# EAGLE design P2 (EAGLE 8.7.1)
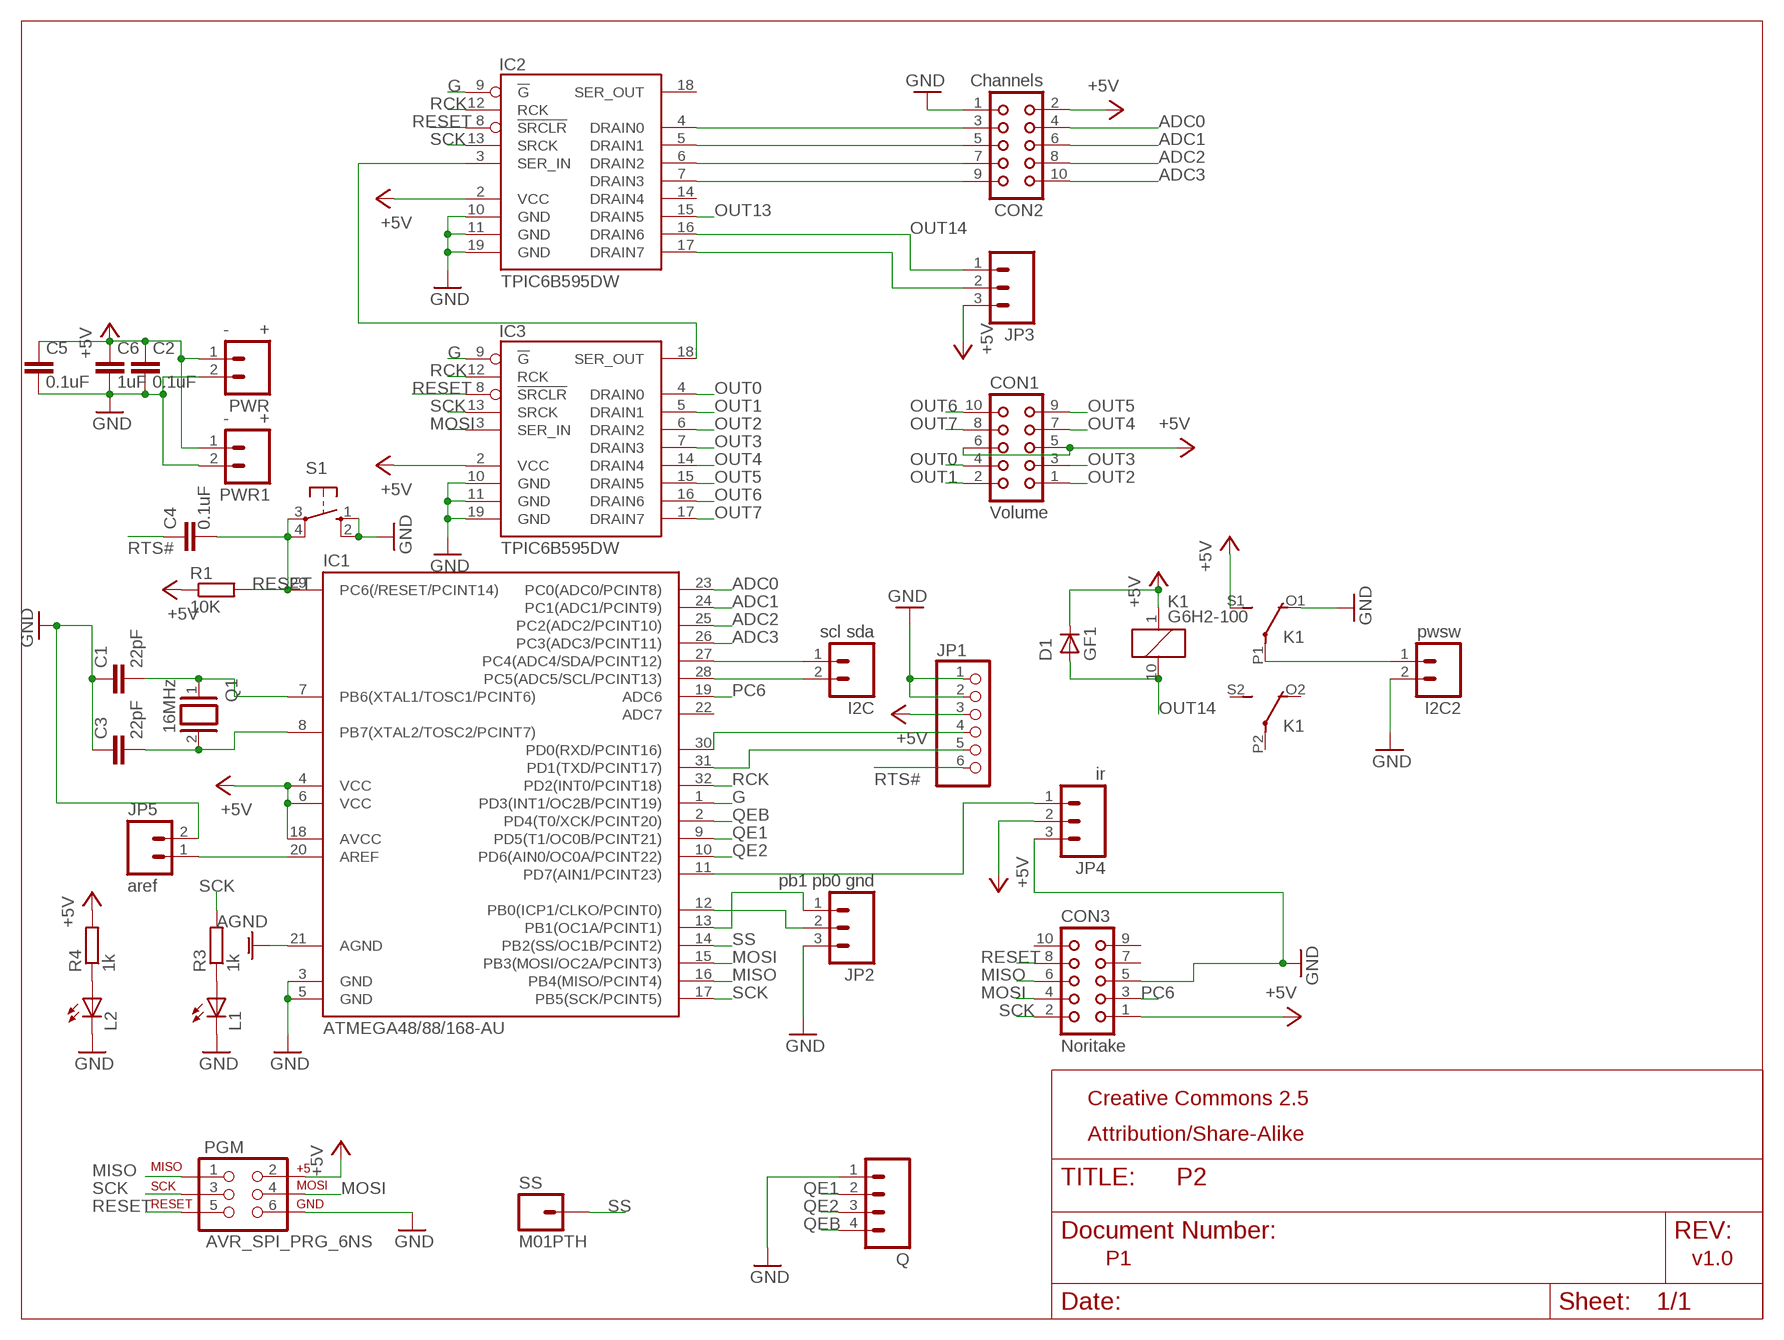
[diagram p0: schematic, sheet 1]

## Parts
C1  22pF  C-EUC0805  [C0805]
C2  0.1uF  C-EUC0805  [C0805]
C3  22pF  C-EUC0805  [C0805]
C4  0.1uF  C-EUC0805  [C0805]
C5  0.1uF  C-EUC0805  [C0805]
C6  1uF  C-EUC0805  [C0805]
CON1  Volume  CON10L  [CON10L]
CON2  Channels  CON10L  [CON10L]
CON3  Noritake  CON10L  [CON10L]
D1  GF1  [SMA-DO214AC]
I2C  scl sda  M02PTH  [1X02]
I2C2  pwsw  M02PTH  [1X02]
IC1  ATMEGA48/88/168-AU  [TQFP32-08]
IC2  TPIC6B595DW  [SO20W]
IC3  TPIC6B595DW  [SO20W]
JP1  PINHD-1X6CLEAN  [1X06-CLEAN]
JP2  pb1 pb0 gnd  M03PTH  [1X03]
JP3  M03PTH  [1X03]
JP4  ir  M03PTH  [1X03]
JP5  aref  M02PTH  [1X02]
K1  G6H2-100  [G6H2-100]
L1  LEDSML0805  [SML0805]
L2  LEDSML0805  [SML0805]
PGM  AVR_SPI_PRG_6NS  [2X3-NS]
PWR  - +  M02PTH  [1X02]
PWR1  - +  M02PTH  [1X02]
Q  M04PTH  [1X04]
Q1  16MHz  XTAL/S  [QS]
R1  10K  R-EU_M0805  [M0805]
R3  1k  R-EU_M0805  [M0805]
R4  1k  R-EU_M0805  [M0805]
S1  10-XX  [B3F-10XX]
SS  M01PTH  [1X01]

## Nets
+5V: C2.1 C5.1 C6.1 CON1.5 CON1.6 CON2.2 CON3.1 D1.K(C) IC1.4(VCC) IC1.6(VCC) IC1.18(AVCC) IC2.2(VCC) IC3.2(VCC) JP1.3 JP3.3 JP4.2 K1.1 K1.S1(2:S) PGM.2 PWR1.1 PWR.1 R1.1 R4.2
ADC0: CON2.4 IC1.23(PC0(ADC0/PCINT8))
ADC1: CON2.6 IC1.24(PC1(ADC1/PCINT9))
ADC2: CON2.8 IC1.25(PC2(ADC2/PCINT10))
ADC3: CON2.10 IC1.26(PC3(ADC3/PCINT11))
AGND: IC1.21(AGND)
G: IC1.1(PD3(INT1/OC2B/PCINT19)) IC2.9(!G) IC3.9(!G)
GND: C1.1 C2.2 C3.1 C5.2 C6.2 CON2.1 CON3.5 I2C2.2 IC1.3(GND) IC1.5(GND) IC2.10(GND) IC2.11(GND) IC2.19(GND) IC3.10(GND) IC3.11(GND) IC3.19(GND) JP1.1 JP1.2 JP2.3 JP4.3 JP5.2 K1.O1(2:O) L1.C L2.C PGM.6 PWR1.2 PWR.2 Q.1 S1.1(S) S1.2(S1)
MISO: CON3.6 IC1.16(PB4(MISO/PCINT4)) PGM.1
MOSI: CON3.4 IC1.15(PB3(MOSI/OC2A/PCINT3)) IC3.3(SER_IN) PGM.4
N$1: C1.2 IC1.7(PB6(XTAL1/TOSC1/PCINT6)) Q1.1
N$2: C3.2 IC1.8(PB7(XTAL2/TOSC2/PCINT7)) Q1.2
N$3: IC1.30(PD0(RXD/PCINT16)) JP1.4
N$4: IC1.31(PD1(TXD/PCINT17)) JP1.5
N$5: I2C2.1 K1.P1(2:P)
N$6: IC2.3(SER_IN) IC3.18(SER_OUT)
N$7: I2C.1 IC1.27(PC4(ADC4/SDA/PCINT12))
N$8: I2C.2 IC1.28(PC5(ADC5/SCL/PCINT13))
N$9: IC1.13(PB1(OC1A/PCINT1)) JP2.1
N$10: IC1.12(PB0(ICP1/CLKO/PCINT0)) JP2.2
N$12: IC2.17(DRAIN7) JP3.2
N$13: IC1.20(AREF) JP5.1
N$14: IC1.11(PD7(AIN1/PCINT23)) JP4.1
N$21: L1.A R3.1
N$22: L2.A R4.1
OUT0: CON1.4 IC3.4(DRAIN0)
OUT1: CON1.2 IC3.5(DRAIN1)
OUT2: CON1.1 IC3.6(DRAIN2)
OUT3: CON1.3 IC3.7(DRAIN3)
OUT4: CON1.7 IC3.14(DRAIN4)
OUT5: CON1.9 IC3.15(DRAIN5)
OUT6: CON1.10 IC3.16(DRAIN6)
OUT7: CON1.8 IC3.17(DRAIN7)
OUT8: CON2.3 IC2.4(DRAIN0)
OUT9: CON2.5 IC2.5(DRAIN1)
OUT10: CON2.7 IC2.6(DRAIN2)
OUT11: CON2.9 IC2.7(DRAIN3)
OUT13: IC2.15(DRAIN5)
OUT14: D1.A IC2.16(DRAIN6) JP3.1 K1.10
PC6: CON3.3 IC1.19(ADC6)
QE1: IC1.9(PD5(T1/OC0B/PCINT21)) Q.2
QE2: IC1.10(PD6(AIN0/OC0A/PCINT22)) Q.3
QEB: IC1.2(PD4(T0/XCK/PCINT20)) Q.4
RCK: IC1.32(PD2(INT0/PCINT18)) IC2.12(RCK) IC3.12(RCK)
RESET: C4.2 CON3.8 IC1.29(PC6(/RESET/PCINT14)) IC2.8(!SRCLR) IC3.8(!SRCLR) PGM.5 R1.2 S1.3(P) S1.4(P1)
RTS#: C4.1 JP1.6
SCK: CON3.2 IC1.17(PB5(SCK/PCINT5)) IC2.13(SRCK) IC3.13(SRCK) PGM.3 R3.2
SS: IC1.14(PB2(SS/OC1B/PCINT2)) SS.1
Unconnected: CON3.7 CON3.9 CON3.10 IC1.22(ADC7) IC2.14(DRAIN4) IC2.18(SER_OUT) K1.O2(3:O) K1.P2(3:P) K1.S2(3:S)

## Notes on the sheet
- Creative Commons 2.5
- Attribution/Share-Alike
- P1 | v1.0

## Library data of the parts
C1-C6 = resistor:C-EU: CAPACITOR, European symbol
CON1-CON3 = con-harting-lars:CON10L: CONNECTOR; OC_FARNELL: unknown; OC_NEWARK: unknown
D1 = diode:GF1: DIODE
I2C I2C2 JP5 PWR PWR1 = SparkFun:M02: Header 2 Standard 2-pin 0.1" header. Use with straight break away headers (SKU : PRT-00116), right angle break away headers (PRT-00553), swiss pins (PRT-00743), machine pins (PRT-00117), and female headers (PRT-00115). Molex polarized connector foot print use with SKU : PRT-08233 with associated crimp pins and housings.
IC1 = atmega8:ATMEGA48/88/168
IC2 IC3 = TPIC6B595:TPIC6B595
JP1 = adafruit:PINHD-1X6: PIN HEADER
JP2-JP4 = SparkFun-Connectors:M03: Header 3 Standard 3-pin 0.1" header. Use with straight break away headers (SKU : PRT-00116), right angle break away headers (PRT-00553), swiss pins (PRT-00743), machine pins (PRT-00117), and female headers (PRT-00115). Molex polarized connector foot print use with SKU : PRT-08232 with associated crimp pins and housings.
K1 = relay:G6H2-100: RELAY 2 x switch, 0.5 A/125 V AC, 1 A/30 V DC, Omron; OC_FARNELL: unknown; OC_NEWARK: unknown
L1 L2 = led:LED: LED OSRAM: - CHIPLED LG R971, LG N971, LY N971, LG Q971, LY Q971, LO R971, LY R971 LH N974, LH R974 LS Q976, LO Q976, LY Q976 LO Q996 - Hyper CHIPLED LW Q18S LB Q993, LB Q99A, LB R99A - SideLED LS A670, LO A670, LY A670, LG A670, LP A670 LB A673, LV A673, LT A673, LW A673 LH A674 LY A675 LS A676, LA A676, LO A676, LY A676, LW A676 LS A679, LY A679, LG A679 - Hyper Micro SIDELED® LS Y876, LA Y876, LO Y876, LY Y876 LT Y87S - SmartLED LW L88C, LW L88S LB L89C, LB L89S, LG L890 LS L89K, LO L89K, LY L89K LS L896, LA L896, LO L896, LY L896 - TOPLED LS T670, LO T670, LY T670, LG T670, LP T670 LSG T670, LSP T670, LSY T670, LOP T670, LYG T670 LG T671, LOG T671, LSG T671 LB T673, LV T673, LT T673, LW T673 LH T674 LS T676, LA T676, LO T676, LY T676, LB T676, LH T676, LSB T676, LW T676 LB T67C, LV T67C, LT T67C, LS T67K, LO T67K, LY T67K, LW E67C LS E67B, LA E67B, LO E67B, LY E67B, LB E67C, LV E67C, LT E67C LW T67C LS T679, LY T679, LG T679 LS T770, LO T770, LY T770, LG T770, LP T770 LB T773, LV T773, LT T773, LW T773 LH T774 LS E675, LA E675, LY E675, LS T675 LS T776, LA T776, LO T776, LY T776, LB T776 LHGB T686 LT T68C, LB T68C - Hyper Mini TOPLED® LB M676 - Mini TOPLED Santana® LG M470 LS M47K, LO M47K, LY M47K Source: http://www.osram.convergy.de LUXEON: - LUMILED® LXK2-PW12-R00, LXK2-PW12-S00, LXK2-PW14-U00, LXK2-PW14-V00 LXK2-PM12-R00, LXK2-PM12-S00, LXK2-PM14-U00 LXK2-PE12-Q00, LXK2-PE12-R00, LXK2-PE12-S00, LXK2-PE14-T00, LXK2-PE14-U00 LXK2-PB12-K00, LXK2-PB12-L00, LXK2-PB12-M00, LXK2-PB14-N00, LXK2-PB14-P00, LXK2-PB14-Q00 LXK2-PR12-L00, LXK2-PR12-M00, LXK2-PR14-Q00, LXK2-PR14-R00 LXK2-PD12-Q00, LXK2-PD12-R00, LXK2-PD12-S00 LXK2-PH12-R00, LXK2-PH12-S00 LXK2-PL12-P00, LXK2-PL12-Q00, LXK2-PL12-R00 Source: www.luxeon.com KINGBRIGHT: KA-3528ASYC Source: www.kingbright.com
PGM = SparkFun:AVR_SPI_PRG_6: AVR ISP 6 Pin This is the reduced ISP connector for AVR programming. Common on Arduino. This footprint will take up less PCB space and can be used with a 10-pin to 6-pin adapter such as SKU: BOB-08508
Q = SparkFun:M04: Header 4 Standard 4-pin 0.1" header. Use with straight break away headers (SKU : PRT-00116), right angle break away headers (PRT-00553), swiss pins (PRT-00743), machine pins (PRT-00117), and female headers (PRT-00115). Molex polarized connector foot print use with SKU : PRT-08231 with associated crimp pins and housings.
Q1 = special:XTAL/S: CRYSTAL
R1 R3 R4 = resistor:R-EU_: RESISTOR, European symbol
S1 = switch-omron:10-XX: OMRON SWITCH; MPN: B3F-1000; OC_FARNELL: 176432; OC_NEWARK: 36M3542
SS = SparkFun-Connectors:M01: Header 1 Standard 1-pin 0.1" header. Use with straight break away headers (SKU : PRT-00116), right angle break away headers (PRT-00553), swiss pins (PRT-00743), machine pins (PRT-00117), and female headers (PRT-00115).

## Board
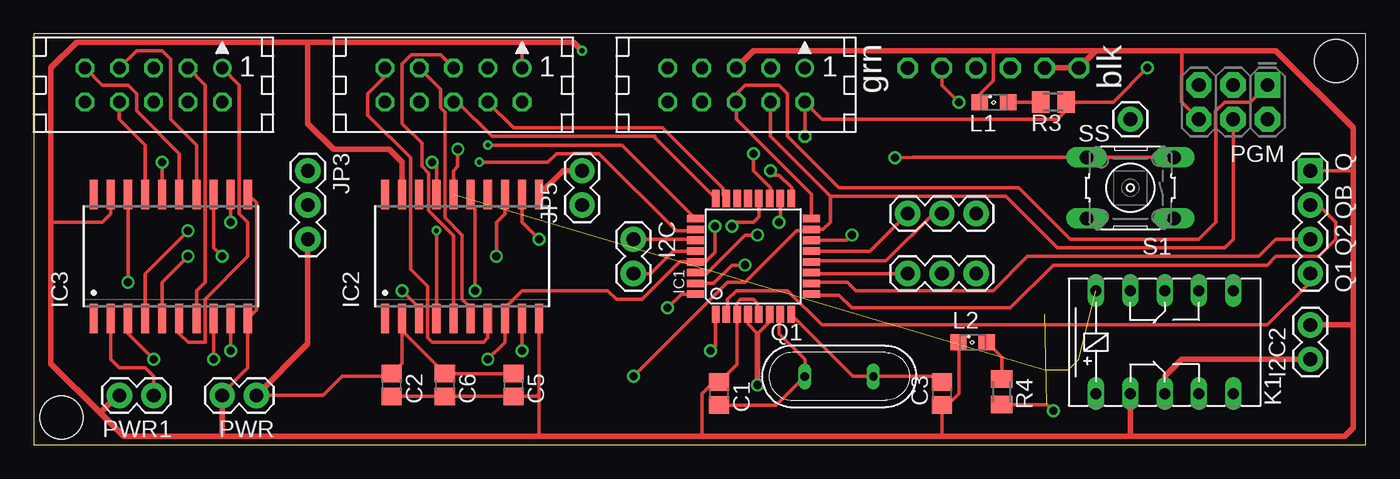
[diagram p1: board, top side]
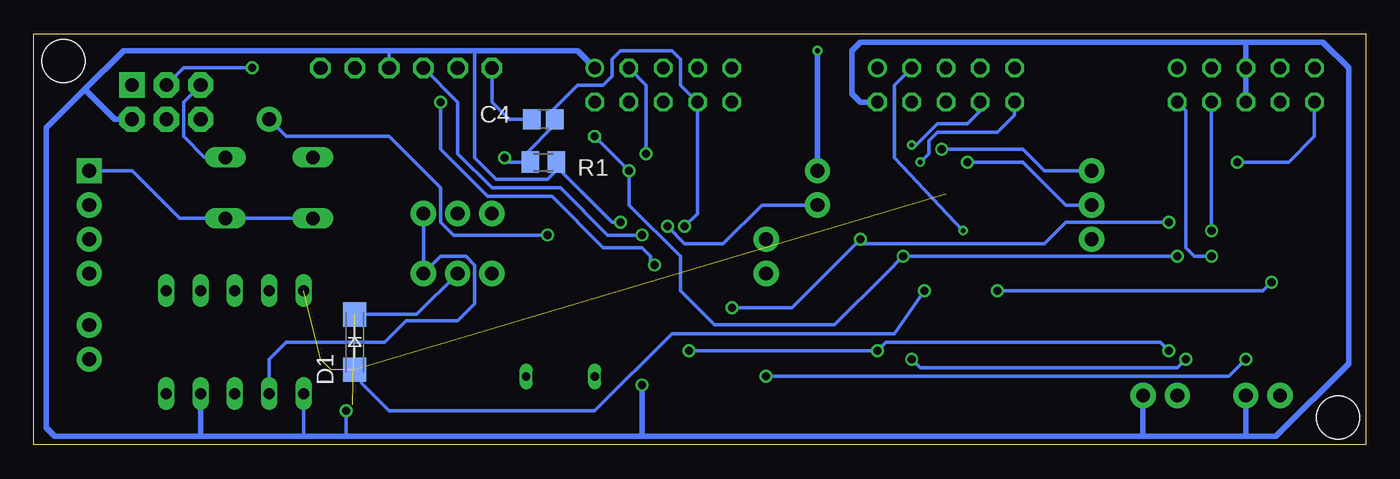
[diagram p2: board, bottom side, seen from below]

Size 98.73 x 30.47 mm. Coordinates in mm from the lower left corner, seen from the top.
Outline: 0,0 98.73,0 98.73,30.47 0,30.47 0,0
Copper layers (1*16): Top 0.0356mm / dielectric 1.5011mm / Bottom 0.0356mm
Design rules "LaenPCBOrder *": minimum track width 6mil, minimum drill 13mil, track to track 6mil, track to pad 6mil, pad to pad 6mil, via to via 6mil, smd to smd 6mil, copper to edge 15mil, drill to drill 6mil, minimum pad ring 7mil, minimum via ring 7mil, stop-mask expansion 4mil, vias tented up to drill 0mil, thermal gap 10mil
Holes 3.2 mm at 2.04,2.04 96.52,28.44

### Footprints (pad centres in the part's own frame; a part is rotated, then mirrored left to right if it is on the bottom)
C0805 = smd 1.3 x 1.5: 1 -0.85,0; 2 0.85,0
CON10L = drill 0.914: 1 5.08,1.27 | drill 0.914 octagon: 2 5.08,-1.27; 3 2.54,1.27; 4 2.54,-1.27; 5 0,1.27; 6 0,-1.27; 7 -2.54,1.27; 8 -2.54,-1.27; 9 -5.08,1.27; 10 -5.08,-1.27
SMA-DO214AC = smd 1.8 x 1.7: A -2.05,0; K 2.05,0
1X02 = drill 1.016 pad 1.88: 1 0,0; 2 2.54,0
TQFP32-08 = smd 1.27 x 0.559: 1 -4.293,2.8; 2 -4.293,2; 3 -4.293,1.2; 4 -4.293,0.4; 5 -4.293,-0.4; 6 -4.293,-1.2; 7 -4.293,-2; 8 -4.293,-2.8; 17 4.293,-2.8; 18 4.293,-2; 19 4.293,-1.2; 20 4.293,-0.4; 21 4.293,0.4; 22 4.293,1.2; 23 4.293,2; 24 4.293,2.8 | smd 0.559 x 1.27: 9 -2.8,-4.293; 10 -2,-4.293; 11 -1.2,-4.293; 12 -0.4,-4.293; 13 0.4,-4.293; 14 1.2,-4.293; 15 2,-4.293; 16 2.8,-4.293; 25 2.8,4.293; 26 2,4.293; 27 1.2,4.293; 28 0.4,4.293; 29 -0.4,4.293; 30 -1.2,4.293; 31 -2,4.293; 32 -2.8,4.293
SO20W = smd 0.6 x 2.2: 1 -5.715,-4.6; 2 -4.445,-4.6; 3 -3.175,-4.6; 4 -1.905,-4.6; 5 -0.635,-4.6; 6 0.635,-4.6; 7 1.905,-4.6; 8 3.175,-4.6; 9 4.445,-4.6; 10 5.715,-4.6; 11 5.715,4.6; 12 4.445,4.6; 13 3.175,4.6; 14 1.905,4.6; 15 0.635,4.6; 16 -0.635,4.6; 17 -1.905,4.6; 18 -3.175,4.6; 19 -4.445,4.6; 20 -5.715,4.6
1X06-CLEAN = drill 1.016 octagon: 1 -6.35,0; 2 -3.81,0; 3 -1.27,0; 4 1.27,0; 5 3.81,0; 6 6.35,0
1X03 = drill 1.016 pad 1.88: 1 0,0; 2 2.54,0; 3 5.08,0
G6H2-100 = drill 0.813 long: 1 -5.08,-3.81; 5 5.08,-3.81; 6 5.08,3.81; 10 -5.08,3.81; O1 -2.54,-3.81; O2 -2.54,3.81; P1 0,-3.81; P2 0,3.81; S1 2.54,-3.81; S2 2.54,3.81
SML0805 = smd 1.2 x 1.2: A 1.05,0; C -1.05,0
2X3-NS = drill 1.016 pad 1.88 square: 1 -2.54,-1.27 | drill 1.016 pad 1.88 octagon: 2 -2.54,1.27; 3 0,-1.27; 4 0,1.27; 5 2.54,-1.27; 6 2.54,1.27
1X04 = drill 1.016 pad 1.88 square: 1 0,0 | drill 1.016 pad 1.88: 2 2.54,0; 3 5.08,0; 4 7.62,0
QS = drill 0.61 long: 1 -2.54,0; 2 2.54,0
M0805 = smd 1.3 x 1.6: 1 -0.95,0; 2 0.95,0
B3F-10XX = drill 1.016 long: 1 -3.251,2.261; 2 3.251,2.261; 3 -3.251,-2.261; 4 3.251,-2.261
1X01 = drill 1.016 pad 1.88: 1 0,0

### Placement (x,y rotation side)
C1  50.8,3.81 270 top
C2  26.54,4.45 270 top
C3  67.31,3.81 90 top
C4  60.96,24.13 0 bottom
C5  35.56,4.45 270 top
C6  30.48,4.45 270 top
CON1  8.89,26.67 0 top
CON2  31.11,26.67 0 top
CON3  52.07,26.67 0 top
D1  74.93,7.62 90 bottom
I2C  44.45,15.24 270 top
I2C2  94.61,6.35 90 top
IC1  53.34,13.97 90 top
IC2  31.75,13.97 0 top
IC3  10.16,13.97 0 top
JP1  71.12,27.94 180 top
JP2  64.77,17.14 0 top
JP3  20.32,20.32 270 top
JP4  64.77,12.7 0 top
JP5  40.64,17.78 90 top
K1  83.82,7.62 0 top
L1  71.17,25.4 0 top
L2  69.58,7.62 0 top
PGM  88.9,25.4 180 top
PWR  16.51,3.67 180 top
PWR1  8.89,3.67 180 top
Q  94.61,20.32 270 top
Q1  59.69,5.08 0 top
R1  60.96,20.95 180 bottom
R3  75.56,25.4 0 top
R4  71.75,3.94 270 top
S1  81.28,19.05 180 top
SS  81.28,24.13 0 top

### Tracks (layer width: path | path; a pad name or v marks a point on that pad's centre or on a via)
+5V  (via drill 0.6)  (1 unrouted)
  Top 0.254: C5.1 C6.1 27.3,8.47 | IC2.2 27.3,8.47 | IC3.2 5.71,6.35 6.35,5.71 8.26,5.71 8.89,5.08 PWR1.1 | PWR.1 21.45,3.67 22.86,5.08 26.32,5.08 C2.1 27.3,6.07 27.3,8.47 | R4.2 75.11,3 v75.56,2.54 | IC1.18 55.34,16.61 v55.24,16.51 | IC1.4 52.94,8.97 53.66,8.26 54.54,9.14 IC1.6
  Top 0.406: v53.66,4.45 53.66,8.26 | JP3.3 20.32,7.49 PWR.1
  Bottom 0.254: 75.56,0.64 v75.56,2.54 | JP4.2 70.34,9.67 D1.K | 66.04,29.21 66.04,21.27 64.45,19.68 60.64,19.68 60.01,20.32 R1.1 59.69,20.95 59.69,20.32 55.88,16.51 v55.24,16.51 | JP1.3 72.39,29.21 | K1.1 78.74,0.64
  Bottom 0.406: CON1.6 CON1.5 8.89,29.84 | 8.89,0.64 16.51,0.64 | 16.51,0.64 53.66,0.64 | 53.66,0.64 75.56,0.64 78.74,0.64 86.36,0.64 | PWR1.1 8.89,0.64 | 8.89,29.84 3.17,29.84 1.27,27.94 1.27,6.03 6.67,0.64 8.89,0.64 | 86.36,0.64 97.16,0.64 97.79,1.27 97.79,23.5 94.93,26.35 | K1.S1 86.36,0.64 | CON3.1 58.42,29.21 66.04,29.21 72.39,29.21 92.08,29.21 94.93,26.35 | 53.66,0.64 v53.66,4.45 | PWR.1 16.51,0.64 | PGM.2 92.71,24.13 94.93,26.35 | 8.89,29.84 37.47,29.84 38.1,29.21 38.1,26.04 37.47,25.4 CON2.2
ADC0
  Top 0.254: IC1.23 51.1,18.5 51.1,19.01 46.62,23.5 35.56,23.5 CON2.4
ADC1
  Top 0.254: IC1.24 46.04,22.77 46.04,22.86 33.97,22.86 31.43,25.4 CON2.6
ADC2  (via drill 0.35)
  Top 0.254: IC1.25 43.59,22.23 v33.66,22.23
  Bottom 0.254: v33.66,22.23 33.34,22.23 31.75,23.81 29.53,23.81 28.57,24.77 CON2.8
ADC3  (via drill 0.35)
  Top 0.254: IC1.26 48.95,15.88 47.62,15.88 41.91,21.59 38.73,21.59 38.1,20.95 v33.02,20.95
  Bottom 0.254: v33.02,20.95 32.38,21.59 32.38,22.54 31.75,23.18 27.3,23.18 26.04,24.45 CON2.10
G  (via drill 0.6)
  Top 0.254: IC3.9 v14.61,6.99 | v36.2,6.99 IC2.9 | IC1.1 50.54,7.36 v50.16,6.99
  Bottom 0.254: v14.61,6.99 15.24,7.62 35.56,7.62 v36.2,6.99 v50.16,6.99
GND  (via drill 0.35)
  Top 0.254: C2.2 C6.2 C5.2 37.25,3.6 37.47,3.81 | 37.47,0.64 37.47,3.81 | 37.47,3.81 IC2.10 | Q.1 97.79,20.32 | IC3.19 5.71,17.14 5.08,16.51 1.27,16.51 | PGM.6 85.09,25.4 85.09,29.21 | 81.23,29.16 81.28,29.21 | PWR.2 13.97,3.81 15.88,5.71 IC3.10 16.51,10.01 16.51,17.93 IC3.11 | 67.31,0.64 C3.1 67.73,2.96 68.58,3.81 68.58,7.57 L2.C | 49.53,0.64 49.53,3.81 50.8,5.08 C1.1 52.14,6 IC1.3 52.07,9.75 52.07,10.48 52.39,10.79 53.34,10.79 53.66,10.48 53.66,9.76 IC1.5 | L1.C 70.12,25.98 71.12,26.99 71.12,29.21 | CON2.1 36.2,29.84
  Top 0.406: JP1.2 JP1.1 78.74,29.21 | 81.28,0.64 67.31,0.64 49.53,0.64 37.47,0.64 13.97,0.64 | 13.97,0.64 6.67,0.64 4.92,2.38 | PWR.2 13.97,0.64 | 81.28,0.64 97.16,0.64 97.79,1.27 97.79,8.89 | 97.79,8.89 97.79,20.32 97.79,23.5 92.08,29.21 85.09,29.21 81.28,29.21 78.74,29.21 | I2C2.2 97.79,8.89 | K1.O1 81.28,0.64 | CON3.5 53.34,29.21 71.12,29.21 78.74,29.21 | 4.92,2.38 1.27,6.03 1.27,16.51 1.27,27.94 3.17,29.84 20.32,29.84 | PWR1.2 6.21,3.67 4.92,2.38 | v40.64,29.21 40.01,29.84 36.2,29.84 20.32,29.84 | IC2.11 39.22,20.32 JP5.2 | IC2.19 27.3,20.95 26.35,21.91 22.23,21.91 20.32,23.81 20.32,29.84
  Bottom 0.254: S1.2 S1.1 87.91,16.79 91.44,20.32 Q.1 | JP2.3 JP4.3 68.58,13.97 66.67,13.97 66.04,13.34 66.04,10.48 67.31,9.21 71.12,9.21 72.71,7.62 80.01,7.62 81.28,6.35 K1.O1
  Bottom 0.406: v40.64,29.21 JP5.2
MISO
  Top 0.254: IC1.16 57.63,18.57 52.07,24.13 CON3.6 52.07,26.04 52.7,26.67 55.24,26.67 55.88,26.04 55.88,22.86 59.69,19.05 73.03,19.05 76.83,15.24 86.36,15.24 87.63,16.51 87.63,24.77 88.27,25.4 90.17,25.4 PGM.1
MOSI  (via drill 0.6)
  Top 0.254: IC1.15 58.52,15.97 59.05,16.51 59.05,18.41 | 59.05,18.41 54.61,22.86 CON3.4 | 88.9,22.23 PGM.4 88.9,15.24 88.27,14.61 75.88,14.61 72.07,18.41 59.05,18.41 | IC3.3 6.99,8.26 v8.89,6.35 | 57.73,15.88 IC1.15 | IC1.15 57.54,15.88 56.52,15.88 52.7,12.06 51.44,12.06 v44.45,5.08
  Bottom 0.254: v8.89,6.35 10.16,5.08 v44.45,5.08
N$1
  Top 0.254: IC1.7 55.24,9.58 55.24,8.26 57.15,6.35 Q1.1 55.03,2.96 C1.2
N$2
  Top 0.254: IC1.8 60.74,5.08 Q1.2 66.89,5.08 C3.2
N$3  (via drill 0.6)
  Top 0.254: 53.34,15.56 v53.66,15.56 52.7,15.56 49.85,12.7 49.12,12.7 IC1.30
  Bottom 0.254: JP1.4 67.31,25.4 67.31,21.59 64.77,19.05 59.69,19.05 56.2,15.56 v53.66,15.56
N$4  (via drill 0.6)
  Top 0.254: JP1.5 67.31,26.67 v68.58,25.4 | IC1.31 50.39,11.97 51.75,13.34 v52.7,13.34
  Bottom 0.254: v68.58,25.4 68.58,21.91 65.09,18.41 60.33,18.41 56.52,14.61 53.66,14.61 53.02,13.97 53.02,13.65 v52.7,13.34
N$5
  Top 0.406: I2C2.1 85.09,6.35 83.82,5.08 K1.P1
N$6  (via drill 0.6)
  Top 0.254: IC3.18 v6.99,12.06 | v27.3,11.43 28.57,10.16 IC2.3
  Bottom 0.254: v6.99,12.06 7.62,11.43 v27.3,11.43
N$7
  Top 0.254: I2C.1 48.98,15.24 IC1.27
N$8
  Top 0.254: I2C.2 45.72,12.7 47.39,14.37 IC1.28
N$9
  Top 0.254: IC1.13 61.99,14.37 JP2.1
N$10
  Top 0.254: JP2.2 66.67,17.14 63.18,13.65 57.72,13.65 IC1.12
N$12  (via drill 0.6)
  Top 0.254: IC2.17 29.84,20.64 v29.53,20.95
  Bottom 0.254: v29.53,20.95 25.4,20.95 22.23,17.78 JP3.2
N$13  (via drill 0.6)
  Top 0.254: IC1.20 53.74,16.91 53.34,16.51 52.07,16.51 v51.75,16.19
  Bottom 0.254: v51.75,16.19 50.48,14.92 47.62,14.92 44.77,17.78 JP5.1
N$14
  Top 0.254: JP4.1 57.7,12.7 IC1.11
N$21
  Top 0.254: R3.1 L1.A
N$22
  Top 0.254: R4.1 71.75,6.5 L2.A
OUT0  (via drill 0.6)
  Top 0.254: v11.43,15.88 8.26,12.7 IC3.4
  Bottom 0.254: CON1.4 v11.43,15.88
OUT1  (via drill 0.6)
  Top 0.254: v11.43,13.97 9.53,12.06 IC3.5
  Bottom 0.254: v11.43,13.97 12.7,13.97 13.34,14.61 13.34,24.77 CON1.2
OUT2
  Top 0.254: CON1.1 15.24,26.67 15.24,17.14 15.88,16.51 15.88,13.97 12.7,10.79 12.7,7.62 11.43,7.62 10.79,8.26 IC3.6
OUT3
  Top 0.254: IC3.7 12.06,11.43 12.7,12.06 12.7,26.67 CON1.3
OUT4
  Top 0.254: IC3.14 12.06,22.23 10.16,24.13 10.16,28.57 9.53,29.21 7.62,29.21 CON1.7
OUT5
  Top 0.254: IC3.15 10.79,21.59 7.62,24.77 7.62,26.04 6.99,26.67 5.08,26.67 CON1.9
OUT6  (via drill 0.6)
  Top 0.254: IC3.16 v9.53,20.95
  Bottom 0.254: v9.53,20.95 5.71,20.95 3.81,22.86 CON1.10
OUT7
  Top 0.254: IC3.17 8.26,22.23 6.35,24.13 CON1.8
OUT8  (via drill 0.35)
  Top 0.254: IC2.4 v29.84,15.88
  Bottom 0.254: CON2.3 34.92,26.67 34.92,21.27 v29.84,15.88
OUT9
  Top 0.254: IC2.5 31.11,15.51 29.27,17.35 29.27,20.15 28.77,20.64 28.77,22.35 27.3,23.81 27.3,28.26 27.95,28.91 30.15,28.91 CON2.5
OUT10
  Top 0.254: CON2.7 30.15,26.36 30.15,25 30.48,24.67 30.48,16.83 31.75,15.56 31.75,10.79 32.38,10.16 IC2.6
OUT11
  Top 0.254: CON2.9 26.04,27.3 24.77,26.04 24.77,25.72 24.77,24.45 27.94,21.27 27.94,13.02 29.21,11.75 29.21,7.94 29.53,7.62 33.34,7.62 33.66,7.94 IC2.7
OUT13  (via drill 0.6)
  Top 0.254: v32.7,11.43 32.7,17.46 32.38,17.78 IC2.15
  Bottom 0.254: v32.7,11.43 34.92,8.26 51.44,8.26 57.15,2.54 72.39,2.54 74.44,4.59 74.44,5.57
OUT14  (via drill 0.6)  (4 unrouted)
  Top 0.254: IC2.16 31.11,20.32 31.43,20.64 v31.43,21.91
  Bottom 0.254: JP3.1 23.81,20.32 25.4,21.91 v31.43,21.91
PC6  (via drill 0.6)
  Top 0.254: v53.34,21.59 53.34,20.32 54.61,19.05 54.61,18.33 IC1.19 54.54,17.85 54.61,17.78
  Bottom 0.254: CON3.3 53.34,26.67 v53.34,21.59
QE1
  Top 0.254: Q.2 95.25,17.78 96.52,16.51 96.52,15.24 95.25,13.97 92.08,13.97 91.44,13.34 75.56,13.34 72.39,10.16 60.64,10.16 59.69,11.11 57.69,11.11 IC1.9
QE2
  Top 0.254: Q.3 92.08,15.24 90.81,13.97 73.66,13.97 71.12,11.43 60.96,11.43 60.33,12.06 57.73,12.06 IC1.10
QEB
  Top 0.254: Q.4 94.61,12.06 91.44,8.89 58.42,8.89 55.88,11.43 52.07,11.43 51.44,10.79 51.44,9.77 IC1.2
RCK  (via drill 0.6)
  Top 0.254: IC3.12 v14.61,16.51 | IC1.32 48,11.17 v46.99,10.16 | v37.47,15.24 36.2,16.51 IC2.12
  Bottom 0.254: v46.99,10.16 42.55,10.16 v37.47,15.24 37.15,14.92 23.81,14.92 22.23,16.51 v14.61,16.51
RESET  (via drill 0.6)
  Top 0.254: S1.3 S1.4 65.13,21.31 v63.82,21.27 | IC3.8 v13.34,6.35 | v33.66,6.35 34.92,7.62 IC2.8 34.92,10.16 36.2,11.43 42.55,11.43 43.18,10.79 45.09,10.79 47.86,13.57 IC1.29 49.13,13.65 49.85,13.65 50.48,14.29 v50.48,16.19
  Bottom 0.254: PGM.5 87.63,25.4 87.63,22.86 86.08,21.31 S1.3 | v33.66,6.35 33.02,5.71 13.97,5.71 v13.34,6.35 | v63.82,21.27 63.5,20.95 R1.2 62.23,21.27 62.23,21.59 60.11,23.71 C4.2 60.33,24.34 60.33,24.77 58.42,26.67 56.52,26.67 55.88,27.3 55.88,28.57 55.24,29.21 51.44,29.21 50.8,28.57 50.8,26.67 CON3.8 49.53,17.14 v50.48,16.19
RTS#
  Bottom 0.254: C4.1 63.5,24.13 64.77,25.4 JP1.6
SCK  (via drill 0.6)
  Top 0.254: v57.15,22.86 CON3.2 58.42,24.13 75.88,24.13 76.52,24.77 R3.2 80.01,25.4 v82.55,27.94 | IC2.13 34.92,17.14 34.29,16.51 v34.29,13.97 | IC3.13 13.34,14.61 v13.97,13.97 | IC1.17 56.2,18.32 56.2,19.05 55.24,20 54.93,20 v54.61,20.32
  Bottom 0.254: v57.15,22.86 v54.61,20.32 54.61,17.78 50.8,13.97 50.8,11.43 48.26,8.89 39.37,8.89 35.56,12.7 v34.29,13.97 v13.97,13.97 | PGM.3 87.63,27.94 v82.55,27.94
SS  (via drill 0.6)
  Top 0.254: IC1.14 60.26,15.17 v60.64,15.56
  Bottom 0.254: v60.64,15.56 67.63,15.56 68.58,16.51 68.58,19.05 72.39,22.86 80.01,22.86 SS.1

### Text on the board
tNames: grn | blk | QB | Q2 | Q1